# EAGLE design power_hub (EAGLE 7.5.0)
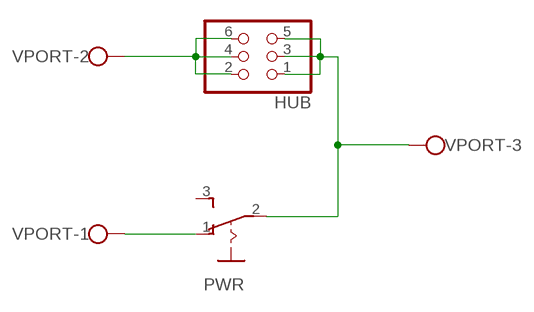
[diagram p0: schematic, sheet 1]

## Parts
HUB  PINHD-2X3  [2X03]
PWR  M251  [M251]
VPORT  W237-103  [W237-103]

## Nets
N$1: PWR.1(O) VPORT.1
N$2: HUB.1 HUB.3 HUB.5 PWR.2(P) VPORT.3
N$3: HUB.2 HUB.4 HUB.6 VPORT.2
Unconnected: PWR.3(S)

## Library data of the parts
HUB = pinhead:PINHD-2X3: PIN HEADER
PWR = switch:M251: SLIDING SWITCH Mors, distributor Buerklin, 11G702
VPORT = con-wago-500:W237-103: WAGO SCREW CLAMP; MPN: 237-103; OC_FARNELL: unknown; OC_NEWARK: 18M7116

## Board
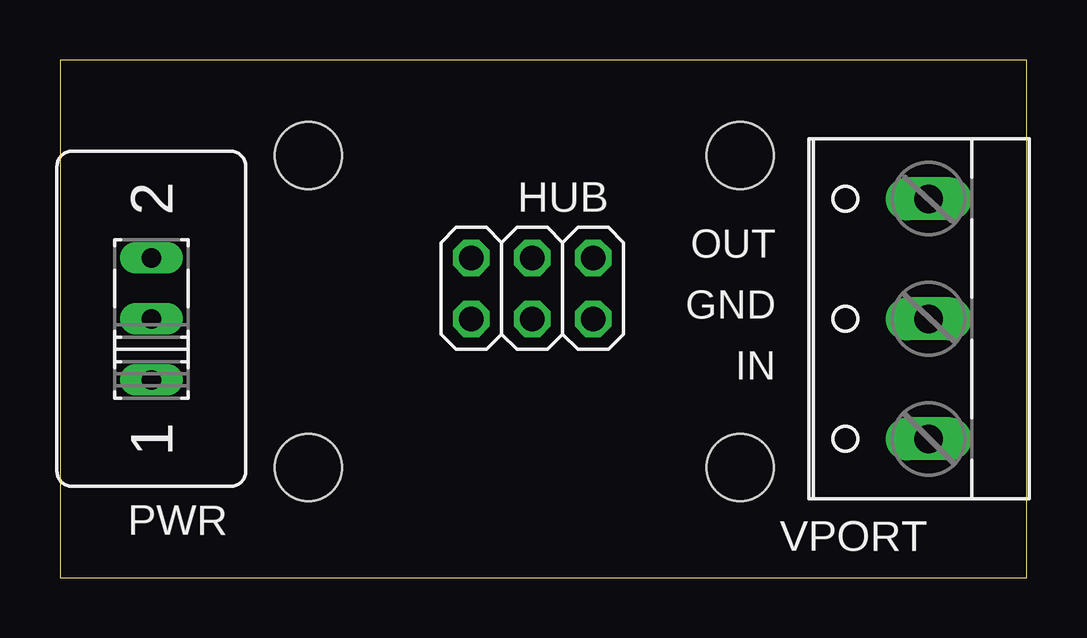
[diagram p1: board, top side]
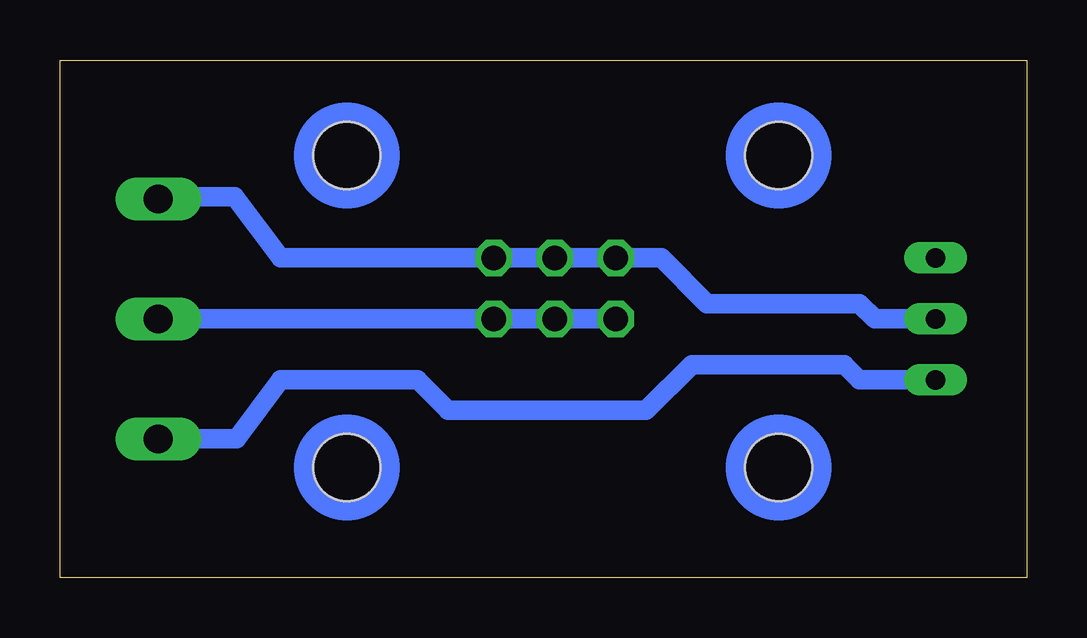
[diagram p2: board, bottom side, seen from below]

Size 40.31 x 21.58 mm. Coordinates in mm from the lower left corner, seen from the top.
Outline: 0,0 40.31,0 40.31,21.58 0,21.58 0,0
Copper layers (1*16): Top 0.035mm / dielectric 1.5mm / Bottom 0.035mm
Design rules "default": minimum track width 10mil, minimum drill 24mil, track to track 8mil, track to pad 8mil, pad to pad 8mil, via to via 8mil, smd to smd 8mil, copper to edge 40mil, drill to drill 8mil, minimum pad ring 10mil, minimum via ring 8mil, stop-mask expansion 4mil, vias tented up to drill 0mil, thermal gap 10mil
Holes 2.8 mm at 10.35,17.6 28.35,17.6 28.35,4.6 10.35,4.6

### Footprints (pad centres in the part's own frame; a part is rotated, then mirrored left to right if it is on the bottom)
2X03 = drill 1.016 octagon: 1 -2.54,-1.27; 2 -2.54,1.27; 3 0,-1.27; 4 0,1.27; 5 2.54,-1.27; 6 2.54,1.27
M251 = drill 0.813 long: 1 -2.54,0; 2 0,0; 3 2.54,0
W237-103 = drill 1.194 long: 1 -5,-1.29; 2 0,-1.29; 3 5,-1.29

### Placement (x,y rotation side)
HUB  19.68,12.07 180 top
PWR  3.81,10.8 90 top
VPORT  34.92,10.8 90 top

### Tracks (layer width: path | path; a pad name or v marks a point on that pad's centre or on a via)
N$1
  Bottom 0.813: VPORT.1 32.94,5.8 31.11,8.25 25.4,8.25 24.13,6.99 15.88,6.99 13.97,8.89 7.62,8.89 6.99,8.25 PWR.1
N$2
  Bottom 0.813: PWR.2 6.35,10.8 6.99,11.43 13.34,11.43 15.24,13.34 HUB.5 HUB.3 HUB.1 31.11,13.34 33.02,15.88 36.13,15.88 VPORT.3
N$3
  Bottom 0.813: HUB.6 HUB.4 HUB.2 VPORT.2
(copper drawn outside any net)
  shapes: Bottom circle x4

### Text on the board
tNames: OUT | GND | IN